# Altium project DustCollectorSwitch.PrjPcb
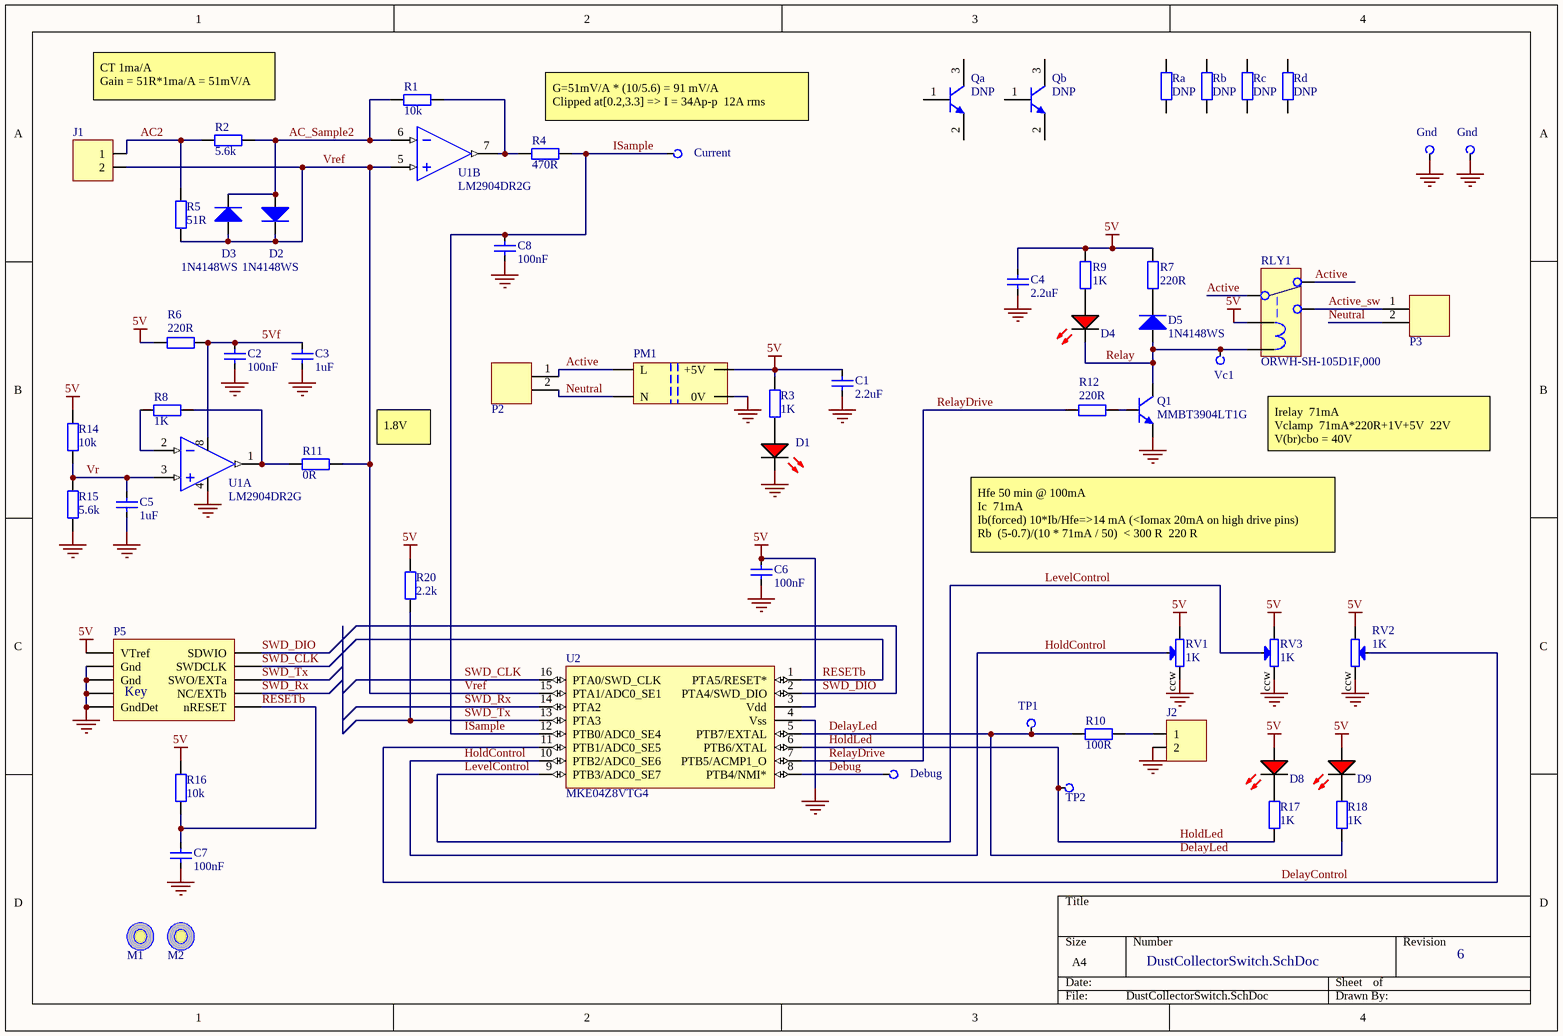
[diagram p0: DustCollectorSwitch.SchDoc]
Version: 6
1 sheet, 61 parts. Net scope: global (net labels, ports and power ports of the same name join across sheets).
Board file: DustCollectorSwitch.PcbDoc

## Sheet DustCollectorSwitch.SchDoc
size A4

### Parts
C1  2.2uF  [CCNP2012-0805]
C2  100nF  [CCNP1608-0603_N]
C3  1uF  [CCNP2012-0805]
C4  2.2uF  [CCNP2012-0805]
C5  1uF  [CCNP2012-0805]
C6  100nF  [CCNP1608-0603_N]
C7  100nF  [CCNP1608-0603_N]
C8  100nF  [CCNP1608-0603_N]
Current  (no value)  [PCBPIN - 0.9mm]  (no BOM)
D1  LED Red  [LED1608-0603-RED]  (value not drawn)
D2  1N4148WS  [SOD-323]
D3  1N4148WS  [SOD-323]
D4  LED Red  [LED1608-0603-RED]  (value not drawn)
D5  1N4148WS  [SOD-323]
D8  LED Red  [LED1608-0603-RED]  (value not drawn)
D9  LED Red  [LED1608-0603-RED]  (value not drawn)
Debug  Vdd  [PCBPIN - 0.9mm]  (value not drawn)  (no BOM)
Gnd1  Gnd  [PCBPIN - 0.9mm]  (no BOM)
Gnd?  Gnd  [PCBPIN - 0.9mm]  (no BOM)
J1  Connector - JST XH 2-Pin  [jst-b2b-xh-ax]  (value not drawn)
J2  Connector - JST XH 2-Pin  [jst-b2b-xh-ax]  (value not drawn)
M1  Mounting hole  [3mm hole]  (value not drawn)  (no BOM)
M2  Mounting hole  [3mm hole]  (value not drawn)  (no BOM)
P2  Terminal2_5.08mm  [MOLEX-39544-3002]  (value not drawn)
P3  Terminal2_5.08mm  [MOLEX-39544-3002]  (value not drawn)
P5  SWD Connector 2x5-Pin  [SWD-2x5-Jig-Pads]  (value not drawn)  (no BOM)
PM1  PowerSupply_AliExpress_5V  [PowerModule_AliExpress_5V]  (value not drawn)
Q1  MMBT3904LT1G  [SOT23_N]
Qa  DNP  [SOT23_M]  (no BOM)
Qb  DNP  [SOT23_M]  (no BOM)
R1  10k  [CR1608-0603_N]
R2  5.6k  [CR1608-0603_N]
R3  1K  [CR1608-0603_N]
R4  470R  [CR1608-0603_N]
R5  51R  [CR1608-0603_N]
R6  220R  [CR1608-0603_N]
R7  220R  [CR1608-0603_N]
R8  1K  [CR1608-0603_N]
R9  1K  [CR1608-0603_N]
R10  100R  [CR1608-0603_N]
R11  0R  [CR1608-0603_N]
R12  220R  [CR1608-0603_N]
R14  10k  [CR1608-0603_N]
R15  5.6k  [CR1608-0603_N]
R16  10k  [CR1608-0603_N]
R17  1K  [CR1608-0603_N]
R18  1K  [CR1608-0603_N]
R20  2.2k  [CR1608-0603_N]
Ra  DNP  [CR1608-0603_N]  (no BOM)
Rb  DNP  [CR1608-0603_N]  (no BOM)
Rc  DNP  [CR1608-0603_N]  (no BOM)
Rd  DNP  [CR1608-0603_N]  (no BOM)
RLY1  ORWH-SH-105D1F,000  [Relay - ORWH-SH]
RV1  1K  [Bourne 3362F-1]
RV2  1K  [Bourne 3362F-1]
RV3  1K  [Bourne 3362F-1]
TP1  (no value)  [PCBPIN - 0.9mm]  (no BOM)
TP2  (no value)  [PCBPIN - 0.9mm]  (no BOM)
U1  LM2904DR2G  [SOIC127P600-8N - rot90]  (parts A,B of 2)
U2  MKE04Z8VTG4  [TSSOP16_N]
Vc1  (no value)  [PCBPIN - 0.9mm]  (no BOM)

### Nets
5V: C1.2 C4.2 C6.2 D8.A D9.A P5.1(VTref) PM1.4(+5V) R3.1 R6.1 R7.1 R9.1 R14.1 R16.1 R20.2 RLY1.C1 RV1.cw RV2.cw RV3.cw U2.3(Vdd)
GND: C1.1 C2.1 C3.1 C4.1 C5.1 C6.1 C7.2 C8.1 D1.K Gnd1.1(TP) Gnd?.1(TP) J2.2 P5.0(Pins) P5.3(Gnd) P5.5(Gnd) P5.9(GndDet) PM1.3(0V) Q1.2(E) R15.1 RV1.ccw RV2.ccw RV3.ccw U1.4(Vee) U2.4(Vss)
5Vf: C2.2 C3.2 R6.2 U1.8(Vcc)
AC2: J1.1 R2.2 R5.1
AC_Sample2: D2.A D3.K R1.1 R2.1 U1.6(INB-)
Active: P2.1 PM1.1(L) RLY1.COM RLY1.NC
Active_sw: P3.1 RLY1.NO
Debug: Debug.1(TP) U2.8(PTB4/NMI*)
DelayControl: RV2.w U2.11(PTB1/ADC0_SE5)
DelayLed: R10.1 R18.1 TP1.1(TP) U2.5(PTB7/EXTAL)
HoldControl: RV1.w U2.10(PTB2/ADC0_SE6)
HoldLed: R17.1 TP2.1(TP) U2.6(PTB6/XTAL)
ISample: C8.2 Current.1(TP) R4.1 U2.12(PTB0/ADC0_SE4)
LevelControl: RV3.w U2.9(PTB3/ADC0_SE7)
Neutral: P2.2 P3.2 PM1.2(N)
Relay: D4.K D5.A Q1.3(C) RLY1.C2 Vc1.1(TP)
RelayDrive: R12.1 U2.7(PTB5/ACMP1_O)
RESETb: C7.1 P5.10(nRESET) R16.2 U2.1(PTA5/RESET*)
SWD_CLK: P5.4(SWDCLK) U2.16(PTA0/SWD_CLK)
SWD_DIO: P5.2(SDWIO) U2.2(PTA4/SWD_DIO)
SWD_Rx: P5.8(NC/EXTb) U2.14(PTA2)
SWD_Tx: P5.6(SWO/EXTa) R20.1 U2.13(PTA3)
Vr: C5.2 R14.2 R15.2 U1.3(INA+)
Vref: D2.K D3.A J1.2 R5.2 R11.1 U1.5(INB+) U2.15(PTA1/ADC0_SE1)
NetD1_A: D1.A R3.2
NetD4_A: D4.A R9.2
NetD5_K: D5.K R7.2
NetD8_K: D8.K R17.2
NetD9_K: D9.K R18.2
NetJ2_1: J2.1 R10.2
NetQ1_1: Q1.1(B) R12.2
NetR1_2: R1.2 R4.2 U1.7(OUTB)
NetR8_1: R8.1 U1.2(INA-)
NetR8_2: R8.2 R11.2 U1.1(OUTA)

Not connected (* = marked no-connect by the designer): Qa 1(B) 2(E) 3(C); Qb 1(B) 2(E) 3(C); Ra 1 2; Rb 1 2; Rc 1 2; Rd 1 2

### Notes on the sheet
- CT 1ma/A
  Gain = 51R*1ma/A = 51mV/A
- G=51mV/A * (10/5.6) = 91 mV/A
  Clipped at[0.2,3.3] => I = 34Ap-p  12A rms
- (near R11) 1.8V
- Irelay  71mA
  Vclamp  71mA*220R+1V+5V  22V
  V(br)cbo = 40V
- Hfe 50 min @ 100mA
  Ic  71mA
  Ib(forced) 10*Ib/Hfe=>14 mA (<Iomax 20mA on high drive pins)
  Rb  (5-0.7)/(10 * 71mA / 50)  < 300 R  220 R
- (in symbol SWD2X5_JIG) Key

### Library data of the parts
C1 C4 = Cap_CCNP_0805_2u2F: 50V 2.2uF X5R ±10% 0805 MLCC; Manufacturer: Generic Components; Class: Passive; SubClass: Capacitor; Published: 08/06/2000; Publisher: Altium Hobart Technology Centre; Farnell PN: *; Digikey: *; LCSC: C377773; Value: 2.2uF
C2 C6-C8 = Cap_CCNP_0603_100nF: Capacitor non-polar SMT 0603; Manufacturer: Generic Components; Class: Passive; Published: 08/06/2000; Publisher: Altium Hobart Technology Centre; SubClass: Capacitor; Farnell PN: *; Digikey: *; Value: 100nF; LCSC: C14663
C3 C5 = Cap_CCNP_0805_1uF: Capacitor non-polar SMT 0805; Manufacturer: Generic Components; Class: Passive; Published: 08/06/2000; Publisher: Altium Hobart Technology Centre; SubClass: Capacitor; Farnell PN: *; Digikey: *; LCSC: C28323; Value: 1uF
Current Debug Gnd1 Gnd? TP1 TP2 Vc1 = TP: Test Point; Digikey: *; Farnell PN: *; LCSC: *
D1 D4 D8 D9 = LED-0603-Red: LED 0603 Red; Manufacturer: Generic Components; Class I: Optoelectronic; Published: 8-Jun-2000; Revision: July-2002: Re-released for DXP Platform.; Publisher: Altium Limited; Class II: LED; Farnell PN: 1581239; Digikey: *; LCSC: C2286
D2 D3 D5 = 1N4148WS: Diode - Switching 100V 150mA 1.25V@150mA 4ns SOD-323; Class: Discrete; SubClass: Diode - Switching; Digikey: *; Farnell PN: 2889105; LCSC: C2128
J1 J2 = JST-B2B-XH-A: LatestRevisionDate: 17-Jul-2002; LatestRevisionNote: Re-released for DXP Platform.; Publisher: Altium Limited; LCSC: *
M1 M2 = Mounting_Hole: LCSC: *
P2 P3 = Terminal2_5.08mm: MULTICOMP MC24366 TERMINAL BLOCK EUROSTYLE, 2 POSITION, 26-12AWG, 5.08mm; Farnell PN: 2396251; LCSC: *
P5 = SWD2X5_JIG: LatestRevisionDate: 17-Jul-2002; LatestRevisionNote: Re-released for DXP Platform.; Publisher: Altium Limited; Farnell PN: 1865285; LCSC: *
Q1 = MMBT3904LT1G: General Purpose Transistor, NPN Silicon, 3-Pin SOT-23, Pb-Free, Tape and Reel; Manufacturer: On Semiconductor; IC Continuous (A): 0.2; fT Min (MHz): 300; ComponentLink2Description: Datasheet; Polarity: NPN; PackageDescription: 3-Pin Small Outline Transistor, Body 2.92 x 1.3 mm, Pitch 0.95 mm; ComponentLink2URL: http://www.onsemi.cn/pub_link/Collateral/MMBT3904LT1-D.PDF; DatasheetVersion: Rev. 12; Mounting Technology: Surface Mount; PartNumber: MMBT3904LT1G; ComponentLink1URL: http://www.onsemi.com/; ComponentLink3Description: Package Specification; ComponentLink1Description: Manufacturer URL; PackageVersion: Rev. AP, 11/2009; PackageReference: SOT-23-3-318-08; Packing: Tape and Reel; ComponentLink3URL: http://www.onsemi.cn/pub_link/Collateral/318-08.PDF; RoHS: TRUE; LCSC: C20526
Qa Qb = MMBT3904LT1G: SOT23; ComponentLink2Description: Datasheet; ComponentLink2URL: http://www.onsemi.cn/pub_link/Collateral/MMBT3904LT1-D.PDF; ComponentLink1URL: http://www.onsemi.com/; ComponentLink3Description: Package Specification; ComponentLink1Description: Manufacturer URL; ComponentLink3URL: http://www.onsemi.cn/pub_link/Collateral/318-08.PDF
R1 R14 R16 = Res_CR0603_10k: 100mW SMT ±1% 0603 Chip Resistor; Manufacturer: Generic Components; Class: Passive; Published: 08/06/2000; Publisher: Altium Hobart Technology Centre; SubClass: Resistor; Farnell PN: *; Digikey: *; LCSC: C25804; Value: 10k
R2 R15 = Res_CR0603_5k6: 100mW SMT ±1% 0603 Chip Resistor; Manufacturer: Generic Components; Class: Passive; Published: 08/06/2000; Publisher: Altium Hobart Technology Centre; SubClass: Resistor; Farnell PN: *; Digikey: *; LCSC: C23189; Value: 5.6k
R3 R8 R9 R17 R18 Ra Rb Rc Rd = Res_CR0603: Resistor SMT 0603; Manufacturer: Generic Components; Class: Passive; Published: 08/06/2000; Publisher: Altium Hobart Technology Centre; SubClass: Resistor; Farnell PN: *; Digikey: *
  R3 R8 R9 R17 R18: Value: 1K; LCSC: C21190
  Ra Rb Rc Rd: Value: DNP
R4 = Res_CR0603_470R: Resistor SMT 0603; Manufacturer: Generic Components; Class: Passive; Published: 08/06/2000; Publisher: Altium Hobart Technology Centre; SubClass: Resistor; Farnell PN: *; Digikey: *; LCSC: C23179; Value: 470R
R5 = Res_CR0603_51R: 100mW SMT ±1% 0603 Chip Resistor; Manufacturer: Generic Components; Class: Passive; Published: 08/06/2000; Publisher: Altium Hobart Technology Centre; SubClass: Resistor; Farnell PN: *; Digikey: *; LCSC: C23197; Value: 51R
R6 R7 R12 = Res_CR0603_220R: Resistor SMT 0603; Manufacturer: Generic Components; Class: Passive; Published: 08/06/2000; Publisher: Altium Hobart Technology Centre; SubClass: Resistor; Farnell PN: *; Digikey: *; LCSC: C22962; Value: 220R
R10 = Res_CR0603_100R: 100mW SMT ±1% 0603 Chip Resistor; Manufacturer: Generic Components; Class: Passive; Published: 08/06/2000; Publisher: Altium Hobart Technology Centre; SubClass: Resistor; Farnell PN: *; Digikey: *; LCSC: C22775; Value: 100R
R11 = Res_CR0603_0R: 100mW SMT ±1% 0603 Chip Resistor; Manufacturer: Generic Components; Class: Passive; Published: 08/06/2000; Publisher: Altium Hobart Technology Centre; SubClass: Resistor; Farnell PN: *; Digikey: *; LCSC: C21189; Value: 0R
R20 = Res_CR0603_2k2: 100mW SMT ±1% 0603 Chip Resistor; Manufacturer: Generic Components; Class: Passive; Published: 08/06/2000; Publisher: Altium Hobart Technology Centre; SubClass: Resistor; Farnell PN: *; Digikey: *; LCSC: C4190; Value: 2.2k
RLY1 = Relay - ORWH-SH-105D1F: Relay, ORWH Series, Power, Non Latching, SPDT, 5 VDC, 10 A; LCSC: *; Farnell PN: 1181034
RV1-RV3 = POT_BOURNS_3362F: Trim Pot - single turn horizontal; Value: 1K; Digikey: *; Farnell PN: 9354298 or similar; LCSC: *
U1 = LM2904DR2G: Single Supply Dual Operational Amplifier, 3 to 32 V, -40 to 105 degC, 8-Pin SOIC, Pb-Free, Tape and Reel; Manufacturer: On Semiconductor; VCC Min (V): 3; VCC Max (V): 32; PackageDescription: 8-Pin Small Outline Integrated Circuit, Body 4.9 x 3.9 mm, Pitch 1.27 mm; RoHS: TRUE; ComponentLink1URL: http://www.onsemi.com/; Mounting Technology: Surface Mount; PackageReference: SOIC-8-751-07; Packing: Tape and Reel; DatasheetVersion: Rev. 27; PartNumber: LM2904DR2G; PackageVersion: Rev. AK, 02/2011; ComponentLink1Description: Manufacturer URL; ComponentLink3URL: http://www.onsemi.com/pub_link/Collateral/751-07.PDF; ComponentLink2Description: Datasheet; ComponentLink3Description: Package Specification; ComponentLink2URL: http://www.onsemi.cn/pub_link/Collateral/LM358-D.PDF; LCSC: C18229
U2 = MKE04Z8VTG4: Kinetis ARM uC; LCSC: *